# EasyEDA Pro project NYS_HW.eprj

# Schematic main
Board Name: nys; Create Date: 2026-05-06; Page Name: P1; Project Name: NYS_HW; Schematic Name: main; Update Date: 2026-05-11; Company: EasyEDA.com; Page Size: A4; Version: V1.0
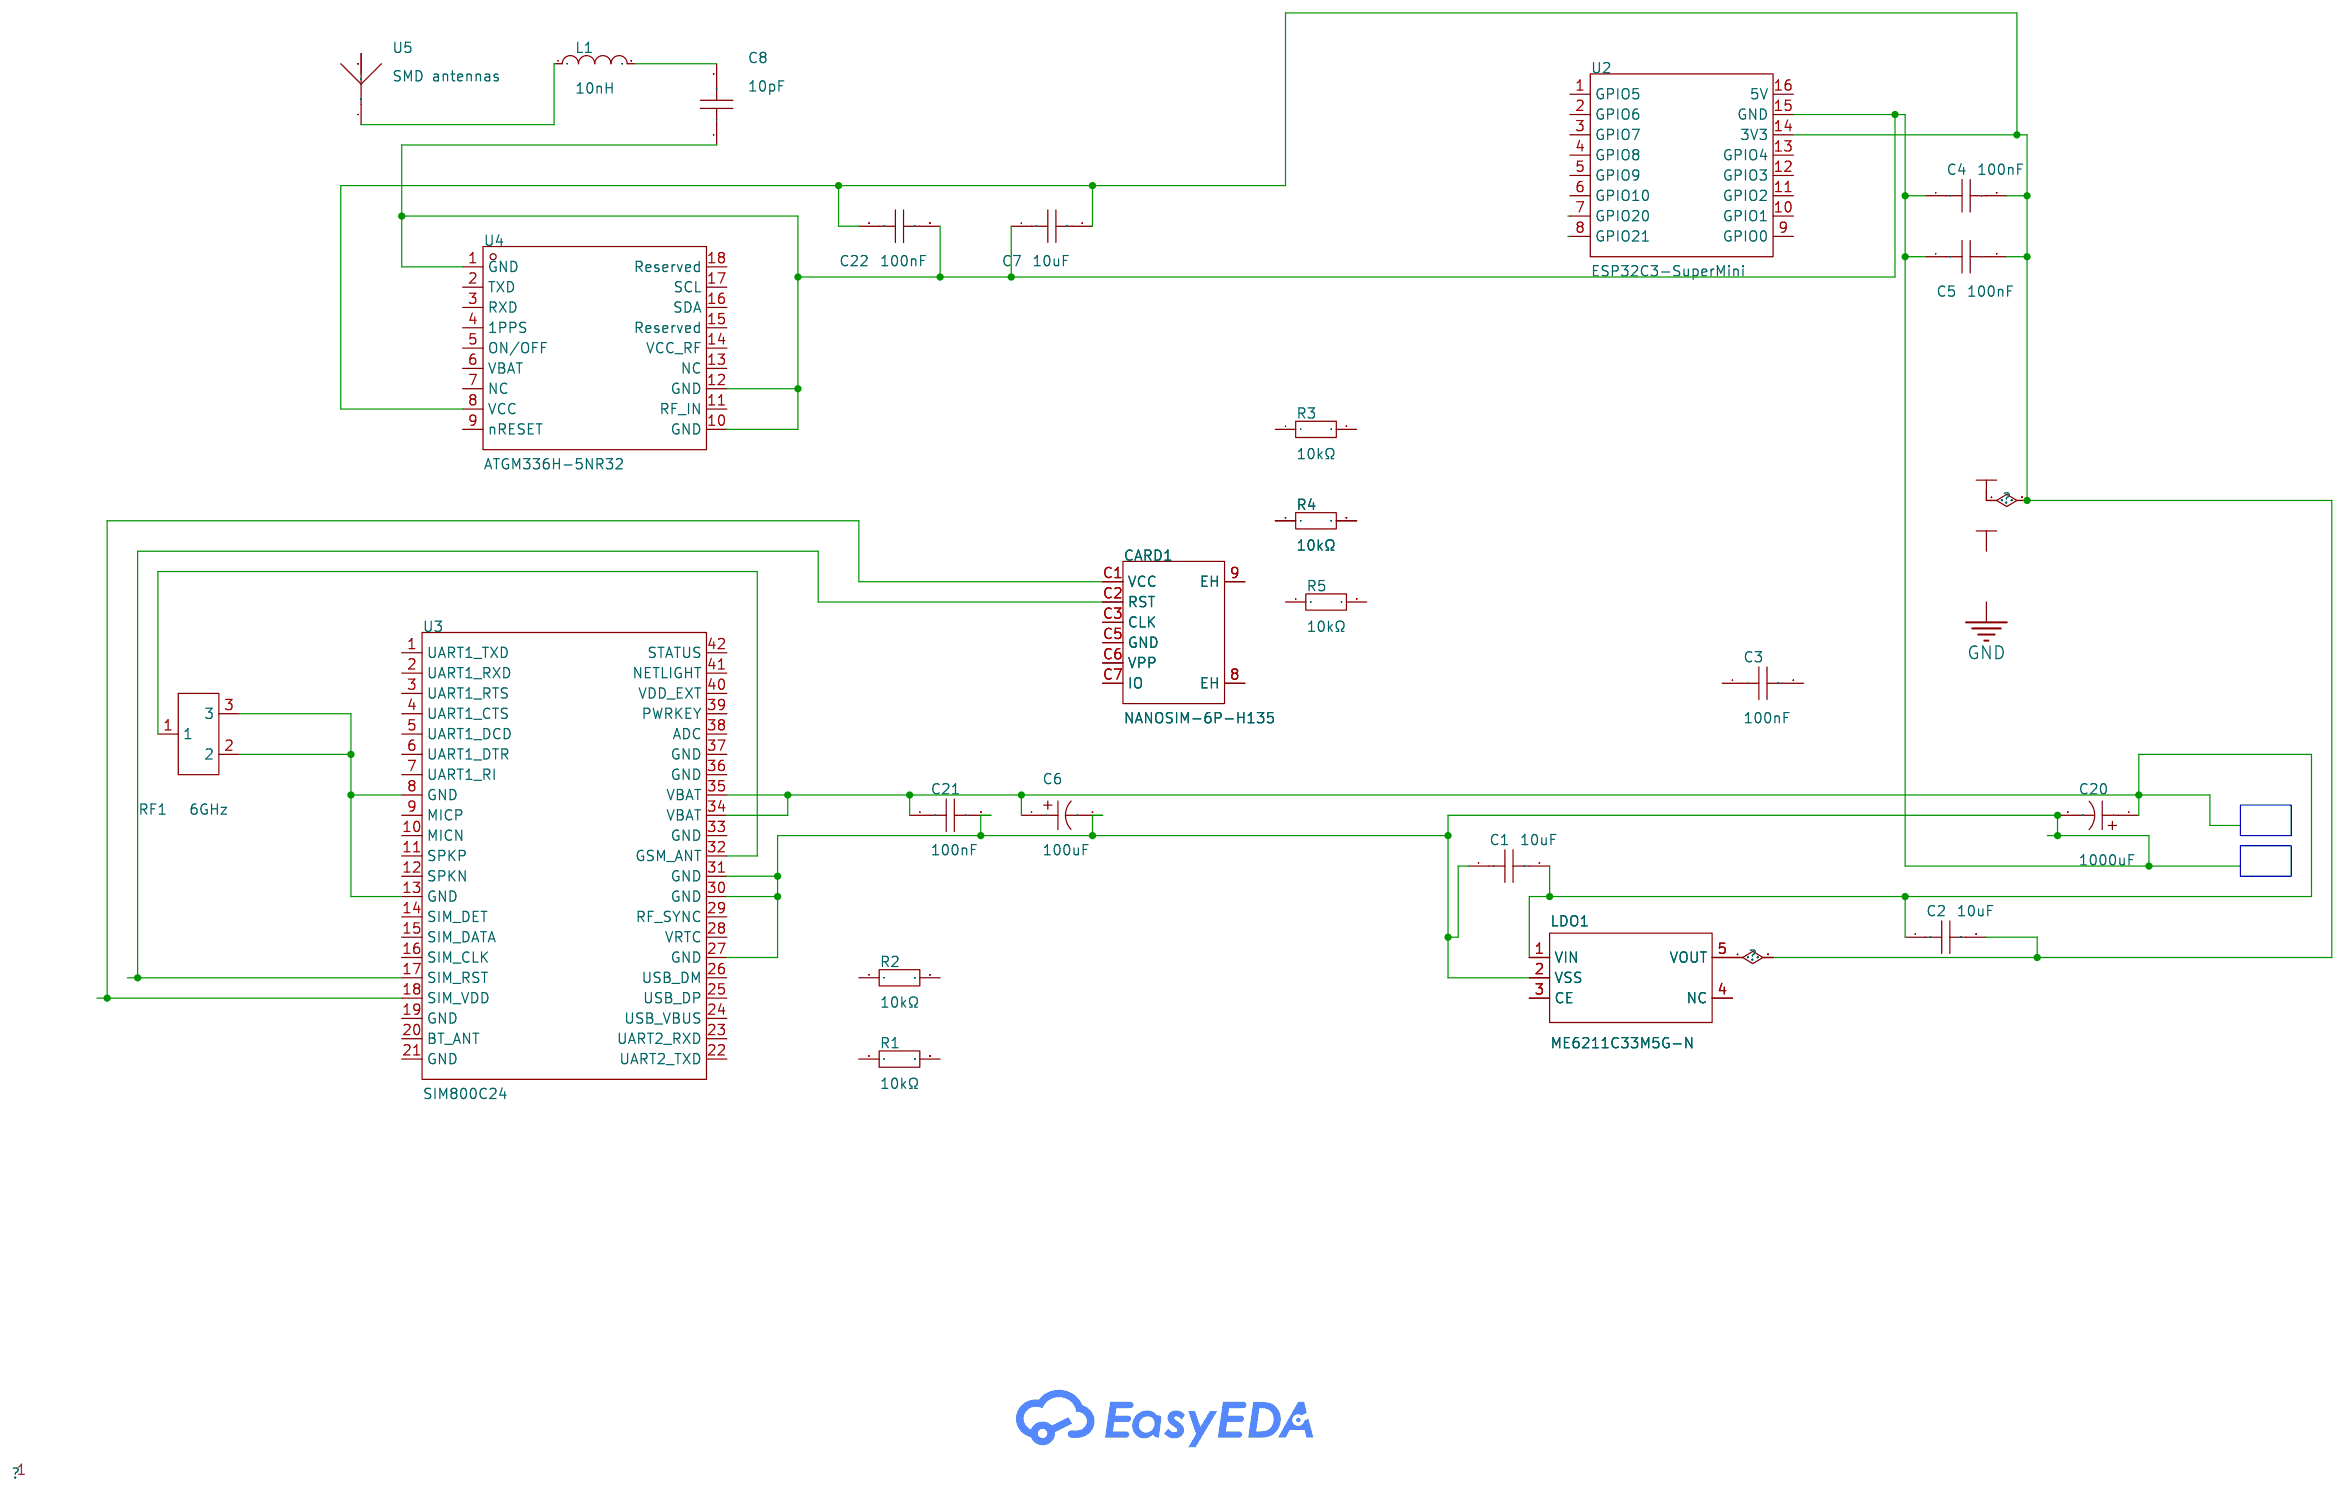
[diagram p0: schematic sheet]

## Parts
C1  10uF  [C0603]
C2  10uF  [C0603]
C3  100nF  [C0603]
C4  100nF  [C0603]
C5  100nF  [C0603]
C6  100uF  [CAP-TH_BD5.0-P2.00-D0.5-FD-1]
C7  10uF  [C0603]
C8  10pF  [C0603]
C20  1000uF  [CAP-TH_BD10.0-P5.00-D0.6-FD]
C21  100nF  [C0603]
C22  100nF  [C0603]
CARD1  NANOSIM-6P-H135  [SIM-SMD_NANOSIM-6P-H135]
L1  10nH  [IND-SMD_L1.6-W0.8-1]
LDO1  ME6211C33M5G-N  [SOT-23-5_L3.0-W1.7-P0.95-LS2.8-BL]
R1  10kΩ  [R0603]
R2  10kΩ  [R0603]
R3  10kΩ  [R0402]
R4  10kΩ  [R0402]
R5  10kΩ  [R0402]
RF1  6GHz  [IPEX-SMD_3P-L2.6-W2.6-LS3.0]
U2  ESP32C3-SuperMini  [COMM-SMD_16P-L22.5-W18.0-P2.54-TL]
U3  SIM800C24  [GSM-SMD_42P-L17.6-W15.7-P1.10-TL]
U4  ATGM336H-5NR32  [GPS-SMD_18P-L10.1-W9.7-P1.10-TL]
U5  SMD antennas  [ANT-SMD_L1.6-W0.8]

## Library data of the parts
C1 C2 C7 = CL10A106KP8NNNC: LCSC Part Name: 10uF ±10% 10V; Supplier Part: C19702; Manufacturer: SAMSUNG(三星); Supplier Footprint: 0603; JLCPCB Part Class: Basic Part; Datasheet: https://item.szlcsc.com/datasheet/CL10A106KP8NNNC/20411.html; Supplier: LCSC; Tolerance: ±10%; Voltage Rating: 10V; Temperature Coefficient: X5R
C3-C5 = CC0603KRX7R9BB104: LCSC Part Name: 100nF ±10% 50V; Supplier Part: C14663; Manufacturer: YAGEO(国巨); Supplier Footprint: 0603; JLCPCB Part Class: Basic Part; Datasheet: https://item.szlcsc.com/datasheet/CC0603KRX7R9BB104/15331.html; Supplier: LCSC; Tolerance: ±10%; Voltage Rating: 50V; Temperature Coefficient: X7R
C6 = 16V100uF CD288: LCSC Part Name: 100uF ±20% 16V; Supplier Part: C2960195; Manufacturer: HRK(鸿瑞凯电子); Supplier Footprint: 插件,D5xL7mm; JLCPCB Part Class: Extended Part; Supplier: LCSC; Tolerance: ±20%; Voltage Rating: 16V; Pin Spacing: 2mm; Diameter: 5mm; Height - Seated (Max): 7mm; Operating Temperature: -40℃~+105℃
C8 = 0603N100C500LT: LCSC Part Name: ±0.25pF 10pF 50V; Supplier Part: C123526; Manufacturer: Walsin(华新科); Supplier Footprint: 0603; JLCPCB Part Class: Extended Part; Datasheet: https://item.szlcsc.com/datasheet/0603N100C500LT/124797.html; Supplier: LCSC; Voltage Rating: 50V; Temperature Coefficient: NP0
C20 = 1000uF 16V: Supplier Part: C439782; Manufacturer: Chengx(承兴); Supplier Footprint: 插件,D10xL13mm; JLCPCB Part Class: Extended Part; Datasheet: https://item.szlcsc.com/datasheet/1000uF%252016V/438882.html; Supplier: LCSC; Voltage Rating: 16V; Ripple Current: 680mA@120Hz; Pin Spacing: 5mm; Diameter: 10mm; Height - Seated (Max): 13mm; Lifetime: 2000hrs@105℃; Operating Temperature: -40℃~+105℃
C21 C22 = 0603Y0160104JDR: LCSC Part Name: 100nF ±5% 16V; Supplier Part: C2311333; Manufacturer: Knowles(楼氏); Supplier Footprint: 0603; JLCPCB Part Class: Extended Part; Datasheet: https://item.szlcsc.com/datasheet/0603Y0160104JDR/2403428.html; Supplier: LCSC; Tolerance: ±5%; Voltage Rating: 16V
CARD1 = NANOSIM-6P-H135: LCSC Part Name: 拔插式 NanoSIM卡 卡座; Supplier Part: C53144697; Manufacturer: BXCONN(宝讯); Supplier Footprint: SMD; JLCPCB Part Class: Extended Part; Datasheet: https://item.szlcsc.com/datasheet/NANOSIM-6P-H135/56138627.html; Supplier: LCSC; Card Connection Mode: Push-Pull; Card Type: Nano-SIM Card; Connector Type: Connector and Ejector; Height Above Board: 1.35mm; Operating Temperature: -40℃~+85℃
L1 = LQW18AN10NJ0ZD: LCSC Part Name: ±5%; Supplier Part: C7521316; Manufacturer: muRata(村田); Supplier Footprint: 0603; JLCPCB Part Class: Extended Part; Datasheet: https://item.szlcsc.com/datasheet/LQW18AN10NJ0ZD/8613909.html; Supplier: LCSC; Tolerance: ±5%; Ratings: AEC-Q200
LDO1 = ME6211C33M5G-N: LCSC Part Name: 输入6V 输出3.3V 500mA; Supplier Part: C82942; Manufacturer: MICRONE(南京微盟); Supplier Footprint: SOT-23-5; JLCPCB Part Class: Extended Part; Datasheet: https://item.szlcsc.com/datasheet/ME6211C33M5G-N/84106.html; Supplier: LCSC; Output Type: Fixed; Voltage - Supply: 6V; Output Voltage: 3.3V; Output Current: 500mA; Power Supply Rejection Ratio (PSRR): 70dB@(1kHz); Voltage Dropout: 120mV@(100mA); standby current: 60uA; Noise: 50uVrms; Features: Over Current Protection；Enable；Short Circuit Protection; Operating Temperature: -40℃~+150℃; Output Configuration: Positive; Number of Outputs: 1
R1 R2 = RMC060310KFN: LCSC Part Name: 厚膜电阻 10kΩ ±1% 100mW; Supplier Part: C269701; Manufacturer: Tyohm(幸亚电阻); Supplier Footprint: 0603; JLCPCB Part Class: Extended Part; Datasheet: https://item.szlcsc.com/datasheet/RMC060310KFN/259141.html; Supplier: LCSC; Type: Thick Film Resistor; Tolerance: ±1%; Power(Watts): 100mW; Voltage-Supply(Max): 50V; Temperature Coefficient: ±100ppm/℃; Operating Temperature: -55℃~+155℃
R3-R5 = RMC040210KFN: LCSC Part Name: 10kΩ ±1% 62.5mW; Supplier Part: C269674; Manufacturer: Tyohm(幸亚电阻); Supplier Footprint: 0402; JLCPCB Part Class: Extended Part; Datasheet: https://item.szlcsc.com/datasheet/RMC040210KFN/259114.html; Supplier: LCSC; Type: Thick Film Resistor; Tolerance: ±1%; Power(Watts): 62.5mW; Voltage-Supply(Max): 50V; Temperature Coefficient: ±100ppm/℃; Operating Temperature: -55℃~+155℃
RF1 = CONUFL001-SMD-T: LCSC Part Name: 内针; Supplier Part: C22418213; Manufacturer: TE Connectivity(泰科电子); Supplier Footprint: SMD; JLCPCB Part Class: Extended Part; Datasheet: https://item.szlcsc.com/datasheet/CONUFL001-SMD-T/24041852.html; Supplier: LCSC; Connector Type: Board Side; Interface: Male Pin; Number of Ports: 1; Impedance: 50Ω; Operating Temperature Range: -40℃~+90℃
U2 = ESP32C3-SuperMini: Supplier Part: C9900147397; Supplier Footprint: SMD-16P; JLCPCB Part Class: Extended Part; Supplier: LCSC
U3 = SIM800C24: LCSC Part Name: GSM/GPRS模块; Supplier Part: C2838066; Manufacturer: SIMCOM(芯讯通无线科技); Supplier Footprint: SMD,17.6x15.7mm; JLCPCB Part Class: Extended Part; Datasheet: https://item.szlcsc.com/datasheet/SIM800C24/3011753.html; Supplier: LCSC; Communication System: GSM；GPRS; Interface: UART；USB；GPIO；ADC；SIM card; Voltage - Supply: 3.4V~4.4V; Features: DTMF function；CMUX function；USSD function；Audio playback and recording function
U4 = ATGM336H-5NR32: LCSC Part Name: BDS/GNSS全星座定位导航模块; Supplier Part: C5117921; Manufacturer: 杭州中科微; Supplier Footprint: LCC-18(10.1x9.7); JLCPCB Part Class: Extended Part; Datasheet: https://item.szlcsc.com/datasheet/ATGM336H-5NR32/5695797.html; Supplier: LCSC; GNSS Type: QZSS；GLONASS；BDS；GALILEO；GPS; Interface: UART; Voltage - Supply: 1.8V~3.6V; Current - Supply: 26mA@3.3V; Sensitivity: -148dBm; Accuracy: 2.5m; Time To First Fix: 35s; Operating Temperature: -40℃~+85℃
U5 = SMD antennas: Supplier Part: C9900132776; Supplier Footprint: SMD0603; JLCPCB Part Class: Extended Part; Supplier: LCSC

## Nets
+3.3V: C2.2 C4.2 C5.2 C7.2 C22.1 LDO1.5(VOUT) U2.14(3V3) U4.8(VCC)
Net-(C1-1): C1.1 C4.1 C5.1 C6.2 C7.1 C8.1 C20.2 C21.2 C22.2 LDO1.2(VSS) U2.15(GND) U3.27(GND) U3.30(GND) U3.31(GND) U4.1(GND) U4.10(GND) U4.12(GND)
Net-(C1-2): C1.2 C2.1 C6.1 C20.1 C21.1 LDO1.1(VIN) U3.34(VBAT) U3.35(VBAT)
Net-(C8-2): C8.2 L1.2
Net-(CARD1-C1): CARD1.C1(VCC) U3.18(SIM_VDD)
Net-(CARD1-C2): CARD1.C2(RST) U3.17(SIM_RST)
Net-(L1-1): L1.1 U5.1(ANT)
Net-(RF1-1): RF1.1 U3.32(GSM_ANT)
Net-(RF1-2): RF1.2 RF1.3 U3.8(GND) U3.13(GND)

Not connected (* = marked no-connect by the designer): C3 1 2; CARD1 8(EH) 9(EH) C3(CLK) C5(GND) C6(VPP) C7(IO); LDO1 3(CE) 4(NC); R1 1 2; R2 1 2; R3 1 2; R4 1 2; R5 1 2; U2 1(GPIO5) 2(GPIO6) 3(GPIO7) 4(GPIO8) 5(GPIO9) 6(GPIO10) 7(GPIO20) 8(GPIO21) 9(GPIO0) 10(GPIO1) 11(GPIO2) 12(GPIO3) 13(GPIO4) 16(5V); U3 1(UART1_TXD) 2(UART1_RXD) 3(UART1_RTS) 4(UART1_CTS) 5(UART1_DCD) 6(UART1_DTR) 7(UART1_RI) 9(MICP) 10(MICN) 11(SPKP) 12(SPKN) 14(SIM_DET) 15(SIM_DATA) 16(SIM_CLK) 19(GND) 20(BT_ANT) 21(GND) 22(UART2_TXD) 23(UART2_RXD) 24(USB_VBUS) 25(USB_DP) 26(USB_DM) 28(VRTC) 29(RF_SYNC) 33(GND) 36(GND) 37(GND) 38(ADC) 39(PWRKEY) 40(VDD_EXT) 41(NETLIGHT) 42(STATUS); U4 2(TXD) 3(RXD) 4(1PPS) 5(ON/OFF) 6(VBAT) 7(NC) 9(nRESET) 11(RF_IN) 13(NC) 14(VCC_RF) 15(Reserved) 16(SDA) 17(SCL) 18(Reserved); U5 2
